# Altium schematic sheet 07-DualFullBridge.SchDoc
size A
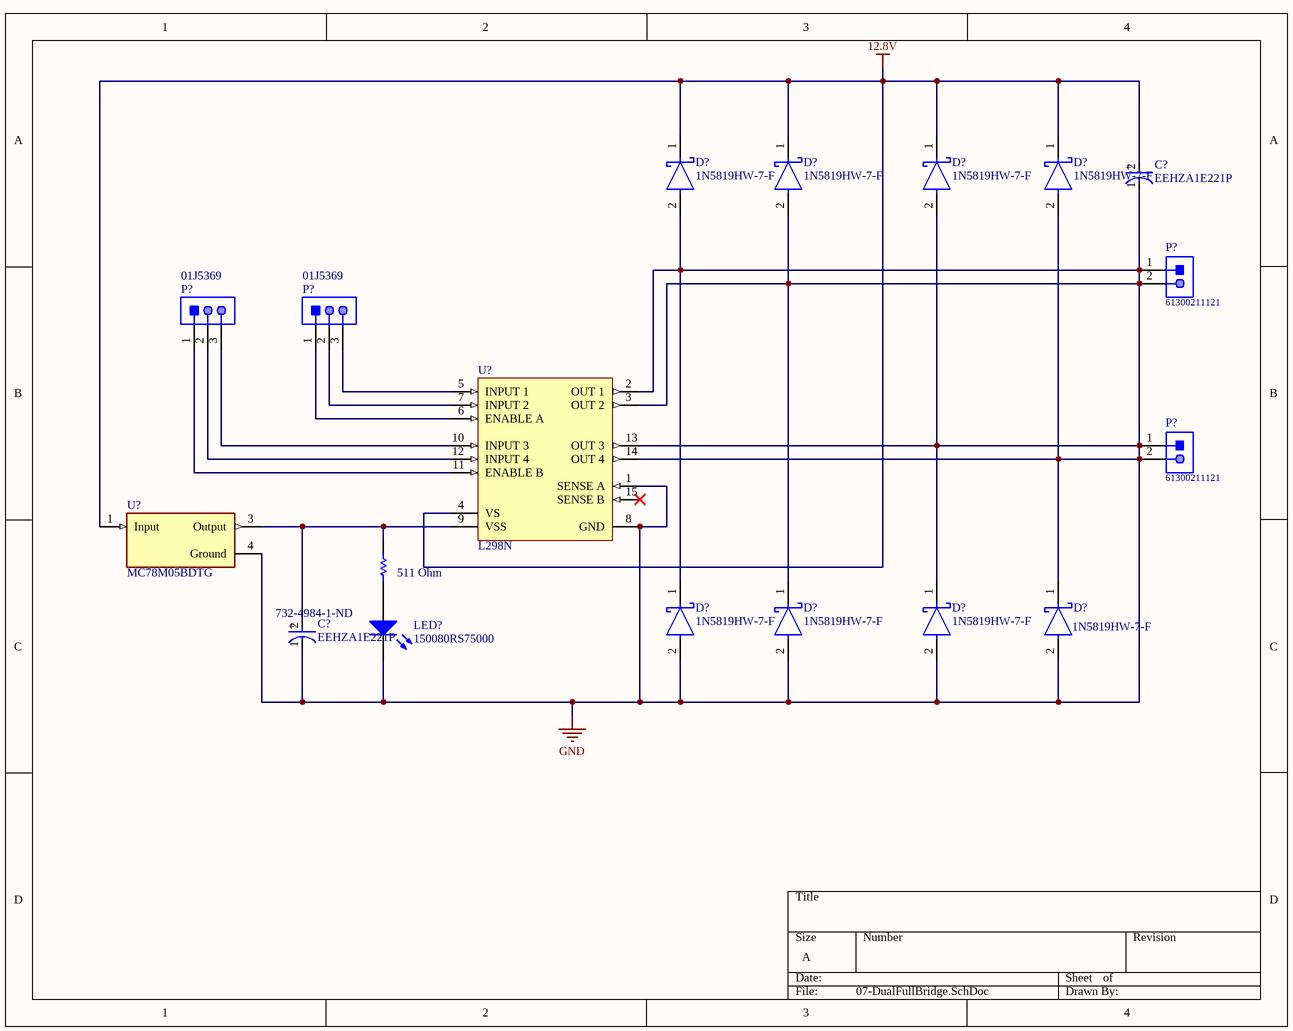
[diagram p0: 07-DualFullBridge.SchDoc]

## Parts
(Parts that share a designator on the sheet are numbered #1, #2 ... from top to bottom, then left to right.)
?  Resistance: 511 Ohm  [RESC2013X70X40ML20T20]  (hidden comment: ERJ-6ENF5110V)
C?#1  EEHZA1E221P  [FP-EEH-F-MFG]
C?#2  EEHZA1E221P  [FP-EEH-F-MFG]
D?#1  1N5819HW-7-F  [FP-SOD123-IPC_A]
D?#2  1N5819HW-7-F  [FP-SOD123-IPC_A]
D?#3  1N5819HW-7-F  [FP-SOD123-IPC_A]
D?#4  1N5819HW-7-F  [FP-SOD123-IPC_A]
D?#5  1N5819HW-7-F  [FP-SOD123-IPC_A]
D?#6  1N5819HW-7-F  [FP-SOD123-IPC_A]
D?#7  1N5819HW-7-F  [FP-SOD123-IPC_A]
D?#8  1N5819HW-7-F  [FP-SOD123-IPC_A]
LED?  150080RS75000  Supplier Part Number 1: 732-4984-1-ND  [0805_A]
P?#1  61300211121  [61300211121]
P?#2  Supplier Part Number 1: 01J5369  [MOLX-22-28-4033_V]  (hidden comment: 22-28-4033)
P?#3  Supplier Part Number 1: 01J5369  [MOLX-22-28-4033_V]  (hidden comment: 22-28-4033)
P?#4  61300211121  [61300211121]
U?#1  L298N  [STM-FM-15]
U?#2  MC78M05BDTG  [FP-369C-MFG]

## Nets
12.8V: C?#1.2(A) D?#1.1(C) D?#2.1(C) D?#3.1(C) D?#4.1(C) U?#1.4(VS) U?#2.1(Input)
GND: C?#1.1(C) C?#2.1(C) D?#1.2(A) D?#2.2(A) D?#3.2(A) D?#4.2(A) D?#5.1(C) D?#5.2(A) D?#6.1(C) D?#6.2(A) D?#7.1(C) D?#7.2(A) D?#8.1(C) D?#8.2(A) LED?.1(K) P?#1.1 P?#1.2 P?#4.1 P?#4.2 U?#1.1(SENSE_A) U?#1.2(OUT_1) U?#1.3(OUT_2) U?#1.8(GND) U?#1.13(OUT_3) U?#1.14(OUT_4) U?#2.4(Ground)
Net?_1: ?.1 LED?.2(A)
Net?_2: ?.2 C?#2.2(A) U?#1.9(VSS) U?#2.3(Output)
NetP?#2_1: P?#2.1 U?#1.11(ENABLE_B)
NetP?#2_2: P?#2.2 U?#1.12(INPUT_4)
NetP?#2_3: P?#2.3 U?#1.10(INPUT_3)
NetP?#3_1: P?#3.1 U?#1.6(ENABLE_A)
NetP?#3_2: P?#3.2 U?#1.7(INPUT_2)
NetP?#3_3: P?#3.3 U?#1.5(INPUT_1)

Not connected (* = marked no-connect by the designer): U?#1 15(SENSE_B)*

## Notes on the sheet
- (in symbol CMP-05428-000269-1) +

## Library data of the parts
? = CMP-2001-00217-1: 511 Ohm Resisitor; Manufacturer: Panasonic; Tolerance: 1%; Power Rating: 125mW; Voltage Rating: 150V; Temperature Coefficient: 100ppm/°C; Part Number: ERJ-6ENF5110V; Supplier 1: Digi-Key; Supplier Part Number 1: P511CCT-ND; Manufacturer Part Number: ERJ-6ENF5110V; RoHS: Yes; Category: Chip SMD Resistors; Stock 1: 53410; Pricing 1: 1=0.10000, 10=0.08800, 100=0.03390, 1000=0.01492, 2500=0.01288 (USD); Mount: Surface Mount; Case/Package: 0805; Case Code (Imperial): 0805; Case Code (Metric): 2012; Contact Plating: Tin; Min Operating Temperature: -55°C; Max Operating Temperature: 155°C; Packaging: Tape and Reel; Package Quantity: 5000; Resistor Type: Thick Film; Number of Terminations: 2; Max Power Dissipation: 125mW; Features: Automotive AEC-Q200; Series: ERJ; Resistance Tolerance: 1%; Termination: SMD/SMT; Construction: Rectangular; Voltage Rating (DC): 150V; Technology: THICK FILM; Length: 2mm; Width: 1.2mm; Height: 0.6mm; Depth: 1.25mm; Radiation Hardening: No; Reach SVHC Compliant: Unknown; Military Standard: Not; Lead Free: Lead Free; RoHS Compliant: Yes; ComponentLink1URL: https://datasheet.ciiva.com/34303/1989421-34303638.pdf?src-supplier=Jameco; ComponentLink1Description: https://datasheet.ciiva.com/34303/1989421-34303638.pdf?src-supplier=Jameco; ComponentLink2URL: https://datasheet.ciiva.com/5870/426256-5870822.pdf?src-supplier=Farnell; ComponentLink2Description: https://datasheet.ciiva.com/5870/426256-5870822.pdf?src-supplier=Farnell; ComponentLink3URL: https://datasheet.ciiva.com/9117/aoa0000ce2-9117326.pdf?src-supplier=Avnet; ComponentLink3Description: https://datasheet.ciiva.com/9117/aoa0000ce2-9117326.pdf?src-supplier=Avnet; ComponentLink4URL: https://datasheet.ciiva.com/24069/aoa0000ce2-24069817.pdf?src-supplier=Mouser; ComponentLink4Description: https://datasheet.ciiva.com/24069/aoa0000ce2-24069817.pdf?src-supplier=Mouser; ComponentLink5URL: https://datasheet.ciiva.com/30247/aoa0000ce2-30247912.pdf?src-supplier=Onlinecomponents.com; ComponentLink5Description: https://datasheet.ciiva.com/30247/aoa0000ce2-30247912.pdf?src-supplier=Onlinecomponents.com; ComponentLink6URL: https://datasheet.ciiva.com/28536/1678782-28536315.pdf?src-supplier=Element14; ComponentLink6Description: https://datasheet.ciiva.com/28536/1678782-28536315.pdf?src-supplier=Element14; ComponentLink7URL: https://datasheet.ciiva.com/16760/70260748-16760587.pdf?src-supplier=Allied+Electronics; ComponentLink7Description: https://datasheet.ciiva.com/16760/70260748-16760587.pdf?src-supplier=Allied+Electronics; ComponentLink8URL: https://datasheet.ciiva.com/46389/426256-46389359.pdf?src-supplier=Element14; ComponentLink8Description: https://datasheet.ciiva.com/46389/426256-46389359.pdf?src-supplier=Element14; ComponentLink9URL: https://datasheet.ciiva.com/46377/426256-46377833.pdf?src-supplier=Element14; ComponentLink9Description: https://datasheet.ciiva.com/46377/426256-46377833.pdf?src-supplier=Element14
C?#1 C?#2 = CMP-05428-000269-1: Conductive Polymer Hybrid Aluminum Electrolytic Capacitors 220uF ±20% 25V RADIAL SMT 8x10.2mm; Lead Diameter: 0.9mm; ESR (Equivalent Series Resistance): 27mR; Leakage Current: 55uA; Ripple Current: 2.3A; Life (Hours): 10000Hour; Min Operating Temperature: -55°C; RoHS Compliant: Yes; Ratings: AEC-Q200; Mount: Surface Mount; Case/Package: Radial; Height - Seated (Max): 0.413inch; Diameter: 8mm; Termination: SMD/SMT; Height: 10.2mm; REACH SVHC: No SVHC; Package Quantity: 500; Length: 10.2mm; Material: Polymer; Voltage Rating: 25V; Voltage Rating (DC): 25V; Lead Free: Lead Free; Tolerance: 20%; Packaging: Tape and Reel; Voltage: 25V; Series: ZA; Radiation Hardening: No; Technology: HYBRID; Ripple Current (AC): 2.3A; Construction: Cylindrical; Capacitance: 220uF; Lead Pitch: 3.1mm; Max Operating Temperature: 105°C
D?#1-D?#8 = CMP-0303-00003-3: DIODE SCHOTTKY 40V 1A SOD123; Forward Voltage: 450mV; Capacitance: 110pF; Max Forward Surge Current (Ifsm): 25A; Peak Reverse Current: 50uA; Polarity: Standard; Element Configuration: Single; Max Power Dissipation: 450mW; Min Operating Temperature: -65°C; Package Quantity: 3000; Contact Plating: Tin; Weight: 0.000353oz; Max Repetitive Reverse Voltage (Vrrm): 40V; Max Reverse Voltage (DC): 40V; Height: 1.25mm; Average Rectified Current: 1A; Width: 1.7mm; Case/Package: SOD-123-2; Lead Free: Lead Free; Max Operating Temperature: 125°C; Current Rating: 1A; Termination: SMD/SMT; Forward Current: 1A; Radiation Hardening: No; Number of Pins: 2; Length: 2.85mm; Voltage Rating (DC): 40V; REACH SVHC: No SVHC; Peak Non-Repetitive Surge Current: 25A; Packaging: Tape and Reel; Output Current: 1A
LED? = CMP-1426-00011-1: SMD mono-color Chip LED, WL-SMCW, Red; Manufacturer: Wuerth Elektronik; Color: Red; PartNumber: 150080RS75000; PackageReference: 0805_A; ComponentLink2Description: Datasheet; ComponentLink1URL: http://www.we-online.com; ComponentLink1Description: Manufacturer URL; ComponentLink2URL: http://katalog.we-online.com/led/datasheet/150080RS75000.pdf; Supplier 1: Digi-Key
P?#1 P?#4 = CMP-1712-00002-4: THT Vertical Pin Header WR-PHD, Pitch 2.54 mm, Single Row, 2 pins; Manufacturer: Wurth Elektronik; Rated Current: 3A; Gender: Male; Withstanding Voltage: 500VAC; Working Voltage: 250VAC; Pitch: 2.54mm; Contact Resistance: 20mOhm; Pin Number: 2; Mounting Technology: THT; Orientation: Vertical; Operating Temperature: -40to105degC; Packaging: Bag; Publisher: WurthElektronik; Datasheet URL: https://katalog.we-online.de/em/datasheet/6130xx11121.pdf; Manufacturer URL: http://www.we-online.de; Row Number: Single; Package Reference: 61300211121; Part Number: 61300211121
P?#2 P?#3 = CMP-1676-00001-5: Male Header, Pitch 2.54 mm, 1 x 3 Position, Height 8.38 mm, Tail Length 3.18 mm, RoHS, Bulk; Manufacturer: Molex; Rows: 1; Voltage Rating: 250 V; Current Rating: 4 A; Description: Header Connector, Pcb Mount, Recept, 3 Contacts, Pin, 0.1 Pitch, Pc Tail Terminal Rohs Compliant: Yes; Number of Positions: 3; Connector Type: Male Pin; Contact Resistance: 20mR; Voltage Rating (DC): 250V; Pitch: 2.54mm; Glow Wire Compliant: Non-compliant; Min Operating Temperature: 0 degC; Lead Pitch: 0.1 inch; Packaging: Bulk; Contact Finish: Gold; RoHSCompliant: true; Contact Material: Brass; PackageReference: 22-28-4033; REACH SVHC: Unknown; PackageDescription: Male Header, Pitch 2.54 mm, 1 x 3 Position, Height 8.38 mm, Tail Length 3.18 mm; ComponentLink2URL: http://www.molex.com/pdm_docs/sd/022284033_sd.pdf; Height: 8.38 mm; Mounting Technology: Through Hole; ComponentLink1Description: Manufacturer URL; Length: 7.62 mm; Mount: Through Hole; DatasheetVersion: Rev. G, 01/2012; Max Operating Temperature: 75 degC; ComponentLink2Description: Datasheet; Colour: Black; Pins: 3; Contact Plating: Gold; Package Quantity: 1; ComponentLink1URL: http://www.molex.com/; Supplier 1: Newark; Manufacturer Part Number: 22-28-4033; RoHS: Yes; Category: Headers and Wire Housings; Stock 1: 21846; Pricing 1: 1=0.13000, 10=0.13000, 25=0.13000, 50=0.11900, 100=0.11900, 250=0.11900 (USD); Color: Black; Housing Material: Nylon; Housing Color: Black; Number of Rows: 1; Termination: Solder; Number of Contacts: 3; Series: KK® 42375; Gender: Male; Contact Type: Male Pin; Orientation: Straight; Number of Circuits: 3; Max Voltage Rating (DC): 250V; Max Voltage Rating (AC): 250V; Contact Mating Length: 0.24inch; Depth: 2.49mm; Radiation Hardening: No; RoHS Compliant: Yes; Flammability Rating: UL94 V-0; Lead Free: Lead Free; ComponentLink3URL: https://datasheet.ciiva.com/6814/022284363-sd-6814049.pdf?src-supplier=Digi-Key; ComponentLink3Description: https://datasheet.ciiva.com/6814/022284363-sd-6814049.pdf?src-supplier=Digi-Key; ComponentLink4URL: https://datasheet.ciiva.com/30254/32400022284033-pcb-headers-30254252.pdf?src-supplier=Onlinecomponents.com; ComponentLink4Description: https://datasheet.ciiva.com/30254/32400022284033-pcb-headers-30254252.pdf?src-supplier=Onlinecomponents.com; ComponentLink5URL: https://datasheet.ciiva.com/5157/0022284033-pcb-headers-228089-5157414.pdf?src-supplier=Mouser; ComponentLink5Description: https://datasheet.ciiva.com/5157/0022284033-pcb-headers-228089-5157414.pdf?src-supplier=Mouser; ComponentLink6URL: https://datasheet.ciiva.com/27050/879465-27050600.pdf?src-supplier=Jameco; ComponentLink6Description: https://datasheet.ciiva.com/27050/879465-27050600.pdf?src-supplier=Jameco; ComponentLink7URL: https://datasheet.ciiva.com/1433/1630767-1433688.pdf?src-supplier=Element14; ComponentLink7Description: https://datasheet.ciiva.com/1433/1630767-1433688.pdf?src-supplier=Element14; ComponentLink8URL: https://datasheet.ciiva.com/10089/0022284033-pcb-headers-10089958.pdf?src-supplier=Avnet; ComponentLink8Description: https://datasheet.ciiva.com/10089/0022284033-pcb-headers-10089958.pdf?src-supplier=Avnet; ComponentLink9URL: https://datasheet.ciiva.com/15217/getdatasheetpartid-163440-15217708.pdf?src-supplier=Verical; ComponentLink9Description: https://datasheet.ciiva.com/15217/getdatasheetpartid-163440-15217708.pdf?src-supplier=Verical
U?#1 = CMP-2000-06526-1: Dual Full-Bridge Driver, 4.8 to 46 V, -40 to 150 degC, 15-Pin FM (MW 15L), RoHS, Tube; Manufacturer: STMicroelectronics; PartNumber: L298; Output Current: 2A; Supply Voltage Max: 7V; Driver Case Style: Multiwatt; Supply Voltage Min: 4.5V; No. of Pins: 15Pins; SVHC: NoSVHC(17-Dec-2015); Output Voltage: 46V; No. of Outputs: 4Outputs; Motor Type: FullBridge; Description: IC BRIDGE DRIVER PAR 15MULTIWATT; Min Supply Voltage: 4.8V; Operating Supply Voltage: 42V; Number of Outputs: 4; Interface: Logic; Max Collector Current: 4A; Fault Protection: Over Temperature; Operating Supply Current: 13mA; Quiescent Current: 500mA; Number of Drivers: 2; Output Impedance: 24mR; MSL: -; Package Description: 15-Pin Flange Mount, Body 5 x 19.6 mm, Pitch 1.27 mm; Datasheet Version: 01/2000; Package Reference: FM-15; Mounting Technology: ThroughHole; Packaging: Each; Automotive Qualification Standard: -; Product Range: -; Datasheet URL: https://datasheet.ciiva.com/15109/getdatasheetpartid-50682-15109332.pdf; Operating Temperature Max: 130°C; Operating Temperature Min: -25°C; Manufacturer URL: http://www.st.com/; Supplier 1: Newark; Supplier Part Number 1: 10WX1394; Manufacturer Part Number: L298N; RoHS: Yes; Category: Motor Drivers; Stock 1: 10321; Pricing 1: 1=7.55000, 10=6.82000, 25=6.51000, 50=6.08000, 100=5.65000, 250=5.40000, 500=5.24000 (USD); Mount: Through Hole; Number of Pins: 15; Min Operating Temperature: -25°C; Max Operating Temperature: 130°C; Max Supply Voltage: 46V; Package Quantity: 25; Series: -; Collector Emitter Voltage (VCEO): 46V; Max Output Current: 2A; Technology: BIPOLAR; Output Current per Channel: 2A; Length: 19.6mm; Width: 5mm; Height: 10.7mm; Radiation Hardening: No; Lead Free: Lead Free; Reach SVHC Compliant: Yes; RoHS Compliant: Yes; ComponentLink1URL: https://datasheet.ciiva.com/14150/ofl298n-647108-dat-en-14150301.pdf?src-supplier=Distrelec; ComponentLink1Description: https://datasheet.ciiva.com/14150/ofl298n-647108-dat-en-14150301.pdf?src-supplier=Distrelec; ComponentLink2URL: https://datasheet.ciiva.com/19456/245403-19456698.pdf?src-supplier=Jameco; ComponentLink2Description: https://datasheet.ciiva.com/19456/245403-19456698.pdf?src-supplier=Jameco; ComponentLink3URL: https://datasheet.ciiva.com/25626/0900766b80060c26-25626619.pdf?src-supplier=RSComponents; ComponentLink3Description: https://datasheet.ciiva.com/25626/0900766b80060c26-25626619.pdf?src-supplier=RSComponents; ComponentLink4URL: https://datasheet.ciiva.com/15109/getdatasheetpartid-50682-15109332.pdf?src-supplier=Verical; ComponentLink4Description: https://datasheet.ciiva.com/15109/getdatasheetpartid-50682-15109332.pdf?src-supplier=Verical; ComponentLink5URL: https://datasheet.ciiva.com/29306/156128-da-01-en-dual-bridge-driv-l298n-29306997.pdf?src-supplier=Conrad; ComponentLink5Description: https://datasheet.ciiva.com/29306/156128-da-01-en-dual-bridge-driv-l298n-29306997.pdf?src-supplier=Conrad; ComponentLink6URL: https://datasheet.ciiva.com/1501/1693054-1501547.pdf?src-supplier=Element14; ComponentLink6Description: https://datasheet.ciiva.com/1501/1693054-1501547.pdf?src-supplier=Element14; ComponentLink7URL: https://datasheet.ciiva.com/1608/1693054-1608165.pdf?src-supplier=Newark; ComponentLink7Description: https://datasheet.ciiva.com/1608/1693054-1608165.pdf?src-supplier=Newark; ComponentLink8URL: https://datasheet.ciiva.com/1500/1693054-1500714.pdf?src-supplier=Element14; ComponentLink8Description: https://datasheet.ciiva.com/1500/1693054-1500714.pdf?src-supplier=Element14; ComponentLink9URL: https://datasheet.ciiva.com/1955/cd00000240-1955436.pdf?src-supplier=Digi-Key; ComponentLink9Description: https://datasheet.ciiva.com/1955/cd00000240-1955436.pdf?src-supplier=Digi-Key; ComponentLink10URL: https://datasheet.ciiva.com/4895/cd00000240-4895919.pdf?src-supplier=Mouser; ComponentLink10Description: https://datasheet.ciiva.com/4895/cd00000240-4895919.pdf?src-supplier=Mouser
U?#2 = CMP-07128-000029-1: IC REG LINEAR 5V 500MA DPAK; Manufacturer: ON Semiconductor; Accuracy Percentage: 4%; Standoff Height: 0mm; Dropout Voltage: 2V; Output Type: Fixed; Nominal Supply Current: 3.2mA; Number Of Outputs: 1; Min Supply Voltage: 7V; Max Supply Voltage: 35V; Max Junction Temp: +125°C; Polarity: Positive; Power Supply Rejection Ratio (PSRR): 80dB; Current Rating: 700mA; Octopart: https://octopart.com/mc78m05bdtg-on+semiconductor-1009693; Device Class L1: Integrated Circuits (ICs); Lead Free: Yes; RoHS: TRUE; Package: 369C; ComponentLink2Description: Datasheet; Footprint Url: https://www.onsemi.com/pub/Collateral/369C.PDF; Mouser Description: Linear Voltage Regulators 5V 500mA Positive; Temperature: -40°C to +125°C; Device Class L3: Voltage Regulators - Linear; ComponentLink2URL: https://www.onsemi.cn/PowerSolutions/document/MC78M00-D.PDF; Digikey Description: IC REG LINEAR 5V 500MA DPAK; Manufacturer Part Number: MC78M05BDTG; Automotive: No; Temperature Range Low: -40°C; Output Current: 500mA; Temperature Range High: +125°C; Height: 2.51mm; Category: IC; Device Class L2: Power Management ICs; Output Voltage: 5V; Supplier 1: Digi-Key; Supplier Part Number 1: MC78M05BDTGOS-ND; Stock 1: 4657; Pricing 1: 1=0.66000, 10=0.58000, 25=0.54480, 100=0.44460, 250=0.41300, 500=0.35150, 1000=0.28120, 2500=0.25484, 5000=0.23726 (USD); Mount: Surface Mount; Case/Package: DPAK; Number of Pins: 3; Contact Plating: Tin,Matte; Min Operating Temperature: -40°C; Max Operating Temperature: 125°C; Packaging: Rail/Tube; Max Input Voltage: 35V; Max Output Current: 500mA; Package Quantity: 75; Min Input Voltage: 7V; Nominal Output Voltage: 5V; Number of Regulators: 1; Min Output Voltage: 5V; Input Bias Current: 3.2mA; Operating Supply Voltage: 35V; Series: -; Output Configuration: Positive; Length: 6.73mm; Width: 6.22mm; Radiation Hardening: No; Reach SVHC Compliant: Yes; Halogen Free: Halogen Free; RoHS Compliant: Yes; ComponentLink1URL: https://datasheet.ciiva.com/2052/mc78m00-d-2052360.pdf?src-supplier=Digi-Key; ComponentLink1Description: https://datasheet.ciiva.com/2052/mc78m00-d-2052360.pdf?src-supplier=Digi-Key; ComponentLink3URL: https://datasheet.ciiva.com/3224/mc78m00-d-3224079.pdf?src-supplier=Avnet; ComponentLink3Description: https://datasheet.ciiva.com/3224/mc78m00-d-3224079.pdf?src-supplier=Avnet; ComponentLink4URL: https://datasheet.ciiva.com/4882/mc78m00-d-88441-4882543.pdf?src-supplier=Mouser; ComponentLink4Description: https://datasheet.ciiva.com/4882/mc78m00-d-88441-4882543.pdf?src-supplier=Mouser; ComponentLink5URL: https://datasheet.ciiva.com/7992/1746757-7992652.pdf?src-supplier=Element14; ComponentLink5Description: https://datasheet.ciiva.com/7992/1746757-7992652.pdf?src-supplier=Element14; ComponentLink6URL: https://datasheet.ciiva.com/16381/mc78m00-d-16381163.pdf?src-supplier=Future+Electronics; ComponentLink6Description: https://datasheet.ciiva.com/16381/mc78m00-d-16381163.pdf?src-supplier=Future+Electronics; ComponentLink7URL: https://datasheet.ciiva.com/18435/70099623-18435694.pdf?src-supplier=Allied+Electronics; ComponentLink7Description: https://datasheet.ciiva.com/18435/70099623-18435694.pdf?src-supplier=Allied+Electronics